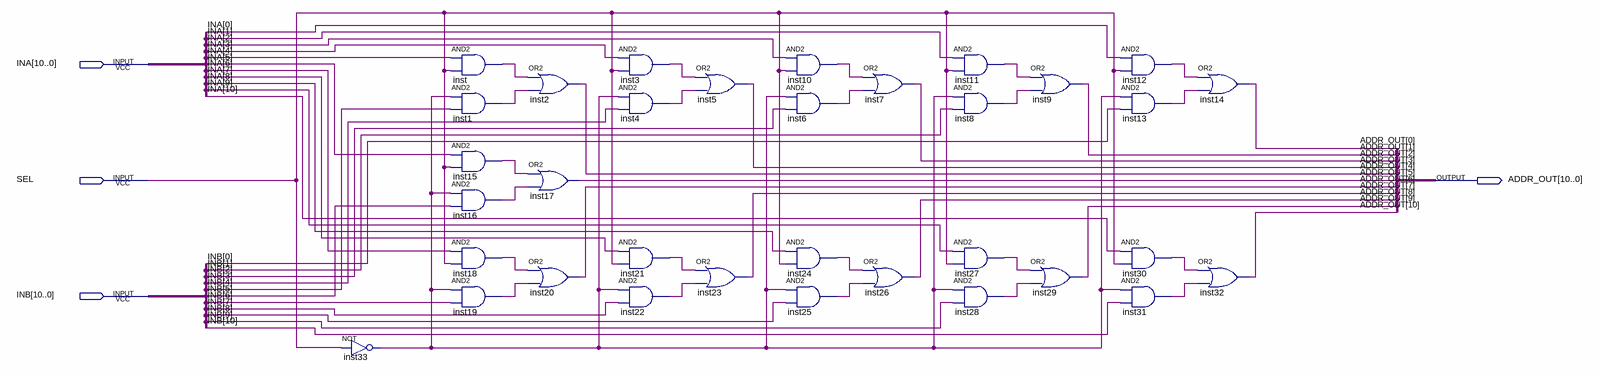
[diagram p0: schematic sheet]
// Quartus schematic MUX_11b.bdf as structural Verilog: 34 symbols, 4 pins
module MUX_11b (
  input  [10:0] INA,
  input  SEL,
  input  [10:0] INB,
  output [10:0] ADDR_OUT
);

  wire inst1_out, inst3_out, inst4_out, inst6_out, inst8_out, inst10_out, inst11_out, inst12_out, inst13_out,
       inst15_out, inst16_out, inst18_out, inst19_out, inst21_out, inst22_out, inst24_out, inst25_out,
       inst27_out, inst28_out, inst30_out, inst31_out, inst33_out, inst_out;

  not inst33 (inst33_out, SEL);
  and inst (inst_out, INA[4], SEL);
  and inst1 (inst1_out, inst33_out, INB[4]);
  and inst15 (inst15_out, INA[5], SEL);
  and inst16 (inst16_out, inst33_out, INB[5]);
  and inst18 (inst18_out, INA[6], SEL);
  and inst19 (inst19_out, inst33_out, INB[6]);
  or inst2 (ADDR_OUT[4], inst_out, inst1_out);
  or inst17 (ADDR_OUT[5], inst15_out, inst16_out);
  or inst20 (ADDR_OUT[6], inst18_out, inst19_out);
  and inst3 (inst3_out, INA[3], SEL);
  and inst4 (inst4_out, inst33_out, INB[3]);
  and inst21 (inst21_out, INA[7], SEL);
  and inst22 (inst22_out, inst33_out, INB[7]);
  or inst5 (ADDR_OUT[3], inst3_out, inst4_out);
  or inst23 (ADDR_OUT[7], inst21_out, inst22_out);
  and inst10 (inst10_out, INA[2], SEL);
  and inst6 (inst6_out, inst33_out, INB[2]);
  and inst24 (inst24_out, INA[8], SEL);
  and inst25 (inst25_out, inst33_out, INB[8]);
  or inst7 (ADDR_OUT[2], inst10_out, inst6_out);
  or inst26 (ADDR_OUT[8], inst24_out, inst25_out);
  and inst11 (inst11_out, INA[1], SEL);
  and inst8 (inst8_out, inst33_out, INB[1]);
  and inst27 (inst27_out, INA[9], SEL);
  and inst28 (inst28_out, inst33_out, INB[9]);
  or inst9 (ADDR_OUT[1], inst11_out, inst8_out);
  or inst29 (ADDR_OUT[9], inst27_out, inst28_out);
  and inst12 (inst12_out, INA[0], SEL);
  and inst13 (inst13_out, inst33_out, INB[0]);
  and inst30 (inst30_out, INA[10], SEL);
  and inst31 (inst31_out, inst33_out, INB[10]);
  or inst14 (ADDR_OUT[0], inst12_out, inst13_out);
  or inst32 (ADDR_OUT[10], inst30_out, inst31_out);
endmodule
